# EAGLE design curve-tracer-trial (EAGLE 9.6.2)
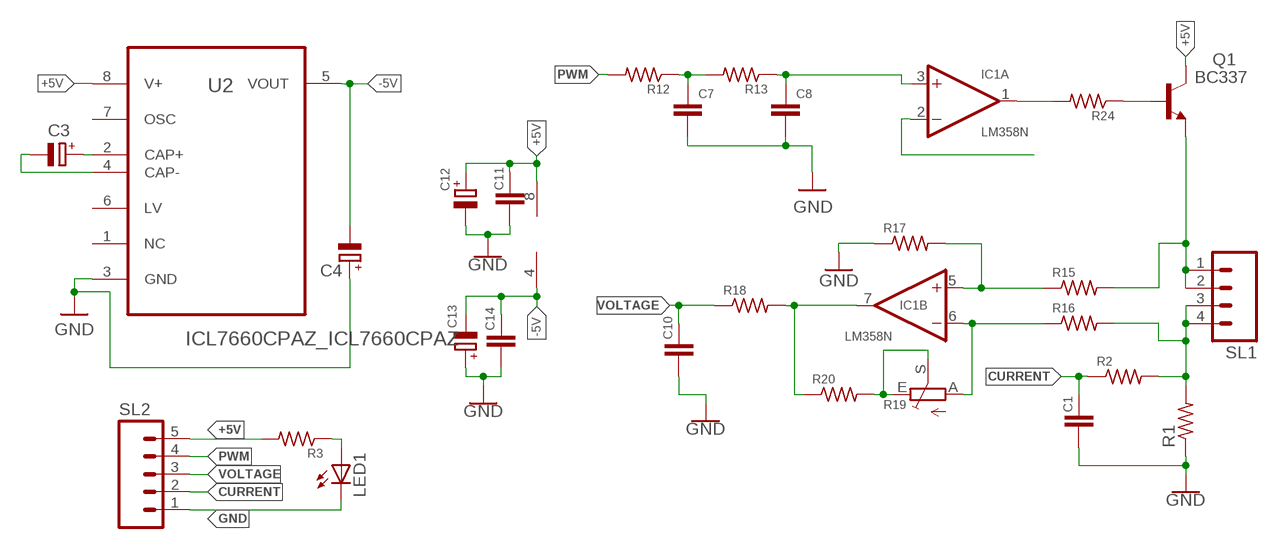
[diagram p0: schematic, sheet 1]

## Parts
C1  C-EU025-025X050  [C025-025X050]
C3  CPOL-EUTT2D5  [TT2D5]
C4  CPOL-EUTT2D5  [TT2D5]
C7  C-EU025-025X050  [C025-025X050]
C8  C-EU025-025X050  [C025-025X050]
C10  C-EU025-025X050  [C025-025X050]
C11  C-EU025-025X050  [C025-025X050]
C12  CPOL-EUTT2D5  [TT2D5]
C13  CPOL-EUTT2D5  [TT2D5]
C14  C-EU025-025X050  [C025-025X050]
IC1  LM358N  [DIL08]
LED1  LED3MM  [LED3MM]
Q1  BC337  [TO92]
R1  RESISTOR0207/10  [0207/10]
R2  R-US_0204/7  [0204/7]
R3  R-US_0204/7  [0204/7]
R12  R-US_0204/7  [0204/7]
R13  R-US_0204/7  [0204/7]
R15  R-US_0204/7  [0204/7]
R16  R-US_0204/7  [0204/7]
R17  R-US_0204/7  [0204/7]
R18  R-US_0204/7  [0204/7]
R19  TRIM_EU-RJ9W  [RJ9W]
R20  R-US_0204/7  [0204/7]
R24  R-US_0204/7  [0204/7]
SL1  M04  [04P]
SL2  M05  [05P]
U2  ICL7660CPAZ_ICL7660CPAZ  [ICL7660CPAZ_DIP254P762X533-8]

## Nets
+5V: C11.1 C12.+ IC1.8(P:V+) Q1.3(C) R3.2 SL2.5 U2.8(V+)
-5V: C4.- C13.- C14.1 IC1.4(P:V-) U2.5(VOUT)
CURRENT: C1.1 R2.1 SL2.2
GND: C1.2 C4.+ C7.2 C8.2 C10.2 C11.2 C12.- C13.+ C14.2 LED1.K(C) R1.1 R17.1 SL2.1 U2.3(GND)
N$1: Q1.1(E) R15.2 SL1.1 SL1.2
N$2: LED1.A R3.1
N$5: IC1.1(A:OUT) R24.2
N$8: IC1.2(A:-IN)
N$9: C3.+ U2.2(CAP+)
N$10: C3.- U2.4(CAP-)
N$11: C7.1 R12.1 R13.2
N$12: R1.2 R2.2 R16.2 SL1.3 SL1.4
N$14: Q1.2(B) R24.1
N$15: C8.1 IC1.3(A:+IN) R13.1
N$17: IC1.5(B:+IN) R15.1 R17.2
N$18: IC1.6(B:-IN) R16.1 R19.A
N$20: R19.E R19.S R20.2
N$21: IC1.7(B:OUT) R18.2 R20.1
PWM: R12.2 SL2.4
VOLTAGE: C10.1 R18.1 SL2.3
Unconnected: U2.1(NC) U2.6(LV) U2.7(OSC)

## Library data of the parts
C1 C7 C8 C10 C11 C14 = rcl:C-EU: CAPACITOR, European symbol; SPICEPREFIX: C
C3 C4 C12 C13 = rcl:CPOL-EU: POLARIZED CAPACITOR, European symbol; SPICEPREFIX: C
IC1 = CEDT_JANUARY_2015_v5:LM358: OP AMP also LM158; LM258; LM2904 Source: http://cache.national.com/ds/LM/LM158.pdf
LED1 = adafruit:LED: LED OSRAM: - CHIPLED LG R971, LG N971, LY N971, LG Q971, LY Q971, LO R971, LY R971 LH N974, LH R974 LS Q976, LO Q976, LY Q976 LO Q996 - Hyper CHIPLED LW Q18S LB Q993, LB Q99A, LB R99A - SideLED LS A670, LO A670, LY A670, LG A670, LP A670 LB A673, LV A673, LT A673, LW A673 LH A674 LY A675 LS A676, LA A676, LO A676, LY A676, LW A676 LS A679, LY A679, LG A679 - Hyper Micro SIDELED® LS Y876, LA Y876, LO Y876, LY Y876 LT Y87S - SmartLED LW L88C, LW L88S LB L89C, LB L89S, LG L890 LS L89K, LO L89K, LY L89K LS L896, LA L896, LO L896, LY L896 - TOPLED LS T670, LO T670, LY T670, LG T670, LP T670 LSG T670, LSP T670, LSY T670, LOP T670, LYG T670 LG T671, LOG T671, LSG T671 LB T673, LV T673, LT T673, LW T673 LH T674 LS T676, LA T676, LO T676, LY T676, LB T676, LH T676, LSB T676, LW T676 LB T67C, LV T67C, LT T67C, LS T67K, LO T67K, LY T67K, LW E67C LS E67B, LA E67B, LO E67B, LY E67B, LB E67C, LV E67C, LT E67C LW T67C LS T679, LY T679, LG T679 LS T770, LO T770, LY T770, LG T770, LP T770 LB T773, LV T773, LT T773, LW T773 LH T774 LS E675, LA E675, LY E675, LS T675 LS T776, LA T776, LO T776, LY T776, LB T776 LHGB T686 LT T68C, LB T68C - Hyper Mini TOPLED® LB M676 - Mini TOPLED Santana® LG M470 LS M47K, LO M47K, LY M47K Source: http://www.osram.convergy.de/
Q1 = transistor-npn:BC337*: NPN Transistor
R1 = CEDT_JANUARY_2015_v5:RESISTOR
R2 R3 R12 R13 R15-R18 R20 R24 = rcl:R-US_: RESISTOR, American symbol; SPICEPREFIX: R
R19 = pot:TRIM_EU-: POTENTIOMETER
SL1 = con-amp-quick:M04: AMP QUICK CONNECTOR; OC_FARNELL: unknown; OC_NEWARK: unknown
SL2 = con-amp-quick:M05: AMP QUICK CONNECTOR; OC_FARNELL: unknown; OC_NEWARK: unknown
U2 = CurveTracer_V6:ICL7660CPAZ_ICL7660CPAZ: CMOS Voltage Converters Check prices <https://pricing.snapeda.com/parts/ICL7660CPAZ/Renesas%20Electronics/view-part?ref=eda>; AVAILABILITY: In Stock; DESCRIPTION: Charge Pump Switching Regulator IC Positive or Negative Fixed -Vin, 2Vin 1 Output 45mA 8-DIP (0.300, 7.62mm); MF: Renesas Electronics; MP: ICL7660CPAZ; PACKAGE: DIP-8 Intersil; PRICE: None

## Net classes
0 default: width 0.508 mm

## Board
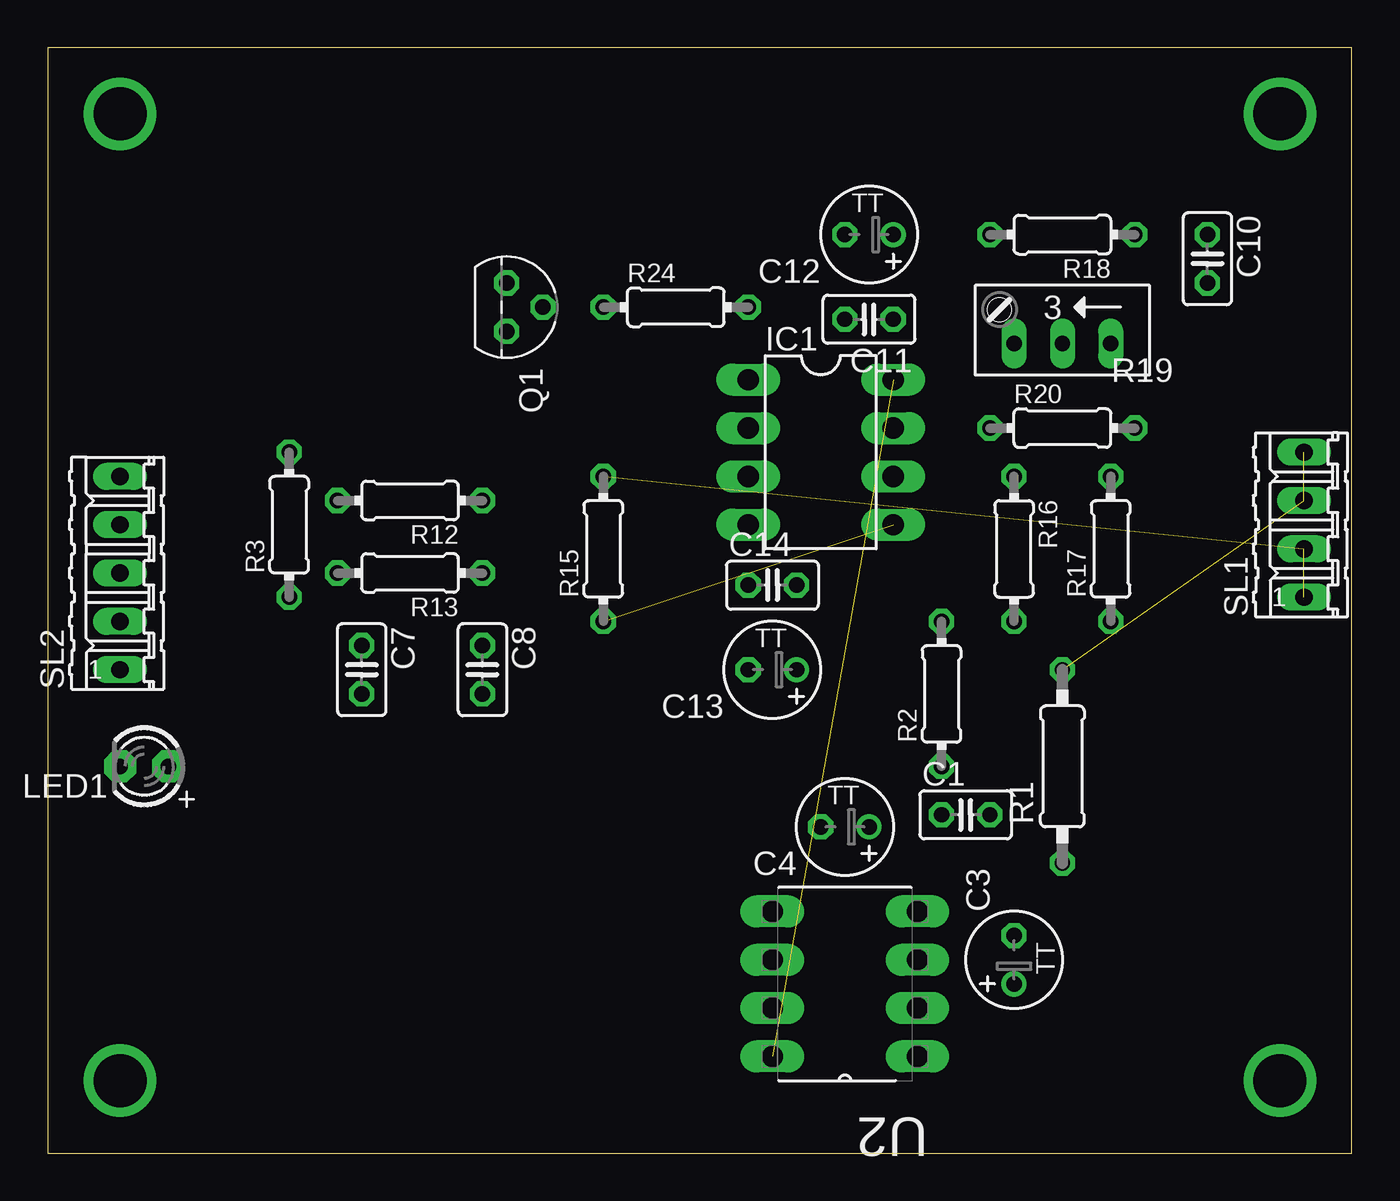
[diagram p1: board, top side]
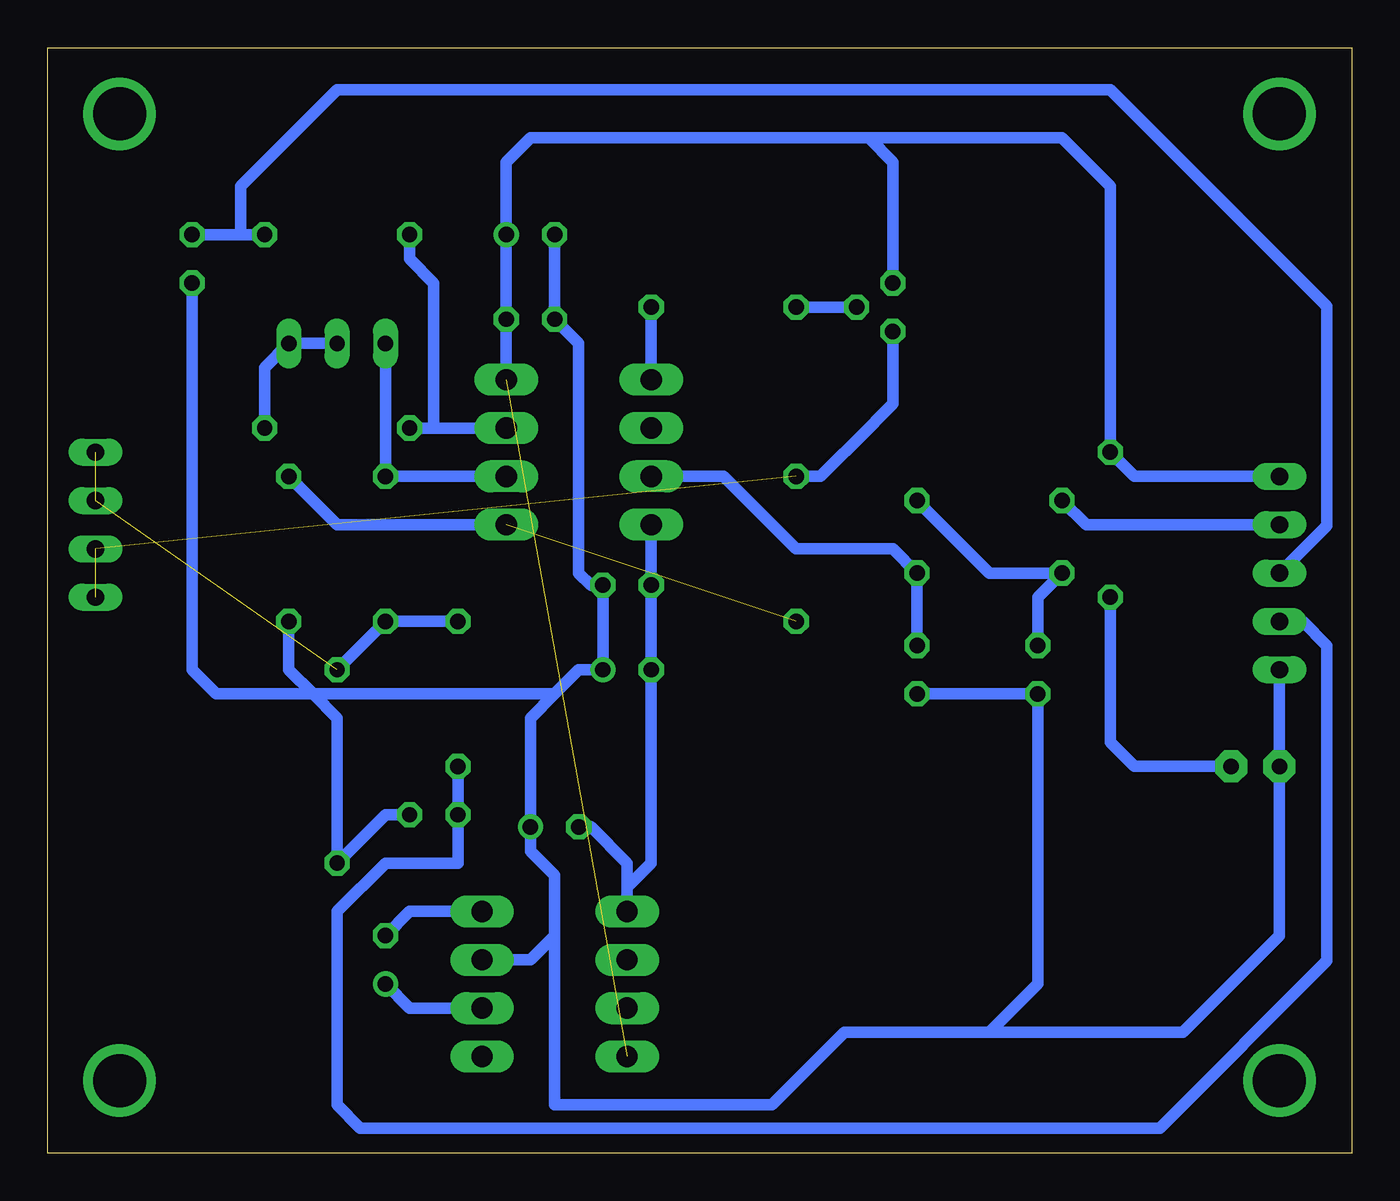
[diagram p2: board, bottom side, seen from below]

Size 68.56 x 58.09 mm. Coordinates in mm from the lower left corner, seen from the top.
Outline: 0,0 68.56,0 68.56,58.09 0,58.09 0,0
Copper layers (1*16): Top 0.035mm / dielectric 1.5mm / Bottom 0.035mm
Design rules "default": minimum track width 6mil, minimum drill 0.35mm, track to track 6mil, track to pad 6mil, pad to pad 6mil, via to via 6mil, smd to smd 6mil, copper to edge 40mil, drill to drill 6mil, minimum pad ring 10mil, minimum via ring 8mil, stop-mask expansion 4mil, vias tented up to drill 0mil, thermal gap 10mil

### Footprints (pad centres in the part's own frame; a part is rotated, then mirrored left to right if it is on the bottom)
C025-025X050 = drill 0.813 octagon: 1 -1.27,0; 2 1.27,0
TT2D5 = drill 0.813: + -1.27,0 | drill 0.813 octagon: - 1.27,0
DIL08 = drill 1.118 long: 1 -3.81,-3.81; 2 -1.27,-3.81; 3 1.27,-3.81; 4 3.81,-3.81; 5 3.81,3.81; 6 1.27,3.81; 7 -1.27,3.81; 8 -3.81,3.81
LED3MM = drill 0.813 pad 1.676 octagon: A -1.27,0; K 1.27,0
TO92 = drill 0.813 octagon: 1 1.27,0; 2 0,1.905; 3 -1.27,0
0207/10 = drill 0.813 octagon: 1 -5.08,0; 2 5.08,0
0204/7 = drill 0.813 octagon: 1 -3.81,0; 2 3.81,0
RJ9W = drill 0.813 long: A 2.54,0.635; E -2.54,0.635; S 0,0.635
04P = drill 0.914 long: 1 -3.81,0; 2 -1.27,0; 3 1.27,0; 4 3.81,0
05P = drill 0.914 long: 1 -5.08,0; 2 -2.54,0; 3 0,0; 4 2.54,0; 5 5.08,0
ICL7660CPAZ_DIP254P762X533-8 = drill 1.118 long: 1 -7.62,7.62; 2 -7.62,5.08; 3 -7.62,2.54; 4 -7.62,0; 5 0,0; 6 0,2.54; 7 0,5.08; 8 0,7.62

### Placement (x,y rotation side)
C1  48.26,17.78 0 top
C3  50.8,10.16 90 top
C4  41.91,17.14 180 top
C7  16.51,25.4 270 top
C8  22.86,25.4 270 top
C10  60.96,46.99 270 top
C11  43.18,43.81 180 top
C12  43.18,48.26 180 top
C13  38.1,25.4 180 top
C14  38.1,29.84 0 top
IC1  40.64,36.83 270 top
LED1  5.08,20.32 180 top
Q1  24.13,44.45 270 top
R1  53.34,20.32 90 top
R2  46.99,24.13 90 top
R3  12.7,33.02 90 top
R12  19.05,34.29 180 top
R13  19.05,30.48 180 top
R15  29.21,31.75 90 top
R16  50.8,31.75 270 top
R17  55.88,31.75 90 top
R18  53.34,48.26 180 top
R19  53.34,43.18 180 top
R20  53.34,38.1 0 top
R24  33.02,44.45 0 top
SL1  66.04,33.02 90 top
SL2  3.81,30.48 90 top
U2  38.1,12.7 180 top

### Tracks (layer width: path | path; a pad name or v marks a point on that pad's centre or on a via)
+5V  (1 unrouted)
  Bottom 0.61: SL2.5 11.43,35.56 R3.2 12.7,50.8 15.24,53.34 25.4,53.34 | IC1.8 C11.1 C12.+ 44.45,52.07 43.18,53.34 25.4,53.34 | Q1.3 24.13,52.07 25.4,53.34
-5V
  Bottom 0.61: U2.5 38.1,13.97 | 38.1,13.97 38.1,15.24 40.01,17.14 C4.- | IC1.4 C14.1 C13.- 36.83,15.24 38.1,13.97
CURRENT
  Bottom 0.61: R2.1 C1.1 46.99,15.24 50.8,15.24 53.34,12.7 53.34,2.54 52.12,1.32 10.11,1.32 1.32,10.11 1.32,26.67 2.59,27.94 SL2.2
GND
  Bottom 0.61: SL2.1 LED1.K 3.81,11.43 8.89,6.35 19.05,6.35 | 41.91,11.43 41.91,14.61 43.18,15.88 C4.+ 43.18,22.86 41.91,24.13 | 41.91,11.43 43.18,10.16 U2.3 | C12.- C11.2 40.64,42.55 40.64,30.48 40.01,29.84 C14.2 C13.+ 40.64,25.4 41.91,24.13 | 41.91,11.43 41.91,2.54 30.48,2.54 26.67,6.35 19.05,6.35 | C8.2 C7.2 16.51,8.89 19.05,6.35 | R17.1 55.88,25.4 54.61,24.13 | 54.61,24.13 41.91,24.13 | C10.2 60.96,25.4 59.69,24.13 54.61,24.13 | 54.61,24.13 53.34,22.86 R1.1 50.8,17.78 C1.2
N$1  (2 unrouted)
  Bottom 0.61: Q1.1 24.13,39.37 24.77,38.73 25.4,38.1 27.94,35.56 R15.2
N$2
  Bottom 0.61: R3.1 12.7,21.59 11.43,20.32 LED1.A
N$3  (via drill 2.79 pad 3.81)
  other vias: 3.81,54.61
N$4  (via drill 2.79 pad 3.81)
  other vias: 64.77,54.61
N$5
  Bottom 0.61: R24.2 IC1.1
N$6  (via drill 2.79 pad 3.81)
  other vias: 3.81,3.81
N$7  (via drill 2.79 pad 3.81)
  other vias: 64.77,3.81
N$9
  Bottom 0.61: C3.+ 49.53,7.62 U2.2
N$10
  Bottom 0.61: U2.4 49.53,12.7 C3.-
N$11
  Bottom 0.61: R12.1 19.05,30.48 R13.2 16.51,29.21 C7.1
N$12  (2 unrouted)
  Bottom 0.61: R1.2 R16.2 R2.2
N$14
  Bottom 0.61: R24.1 Q1.2
N$15
  Bottom 0.61: C8.1 R13.1 24.13,31.75 29.21,31.75 33.02,35.56 IC1.3
N$17  (1 unrouted)
  Bottom 0.61: R17.2 53.34,33.02 IC1.5
N$18
  Bottom 0.61: IC1.6 R16.1 R19.A
N$20
  Bottom 0.61: R19.S R19.E 57.15,41.27 R20.2
N$21
  Bottom 0.61: IC1.7 48.26,38.1 | 48.26,38.1 R20.1 | R18.2 49.53,46.99 48.26,45.72 48.26,38.1
PWM
  Bottom 0.61: R12.2 13.97,33.02 SL2.4
VOLTAGE
  Bottom 0.61: R18.1 58.42,48.26 | 58.42,48.26 C10.1 | SL2.3 1.32,32.97 1.32,44.5 12.7,55.88 53.34,55.88 58.42,50.8 58.42,48.26